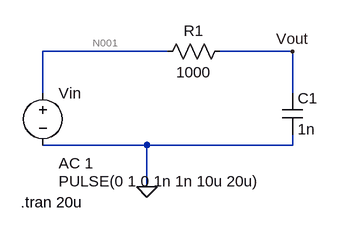
[diagram p0: schematic Draft1.asc]
Draft1.asc, the LTspice schematic file:
Version 4
SHEET 1 880 680
WIRE 160 96 -32 96
WIRE 352 96 240 96
WIRE -32 160 -32 96
WIRE 352 160 352 96
WIRE 128 240 -32 240
WIRE 352 240 352 224
WIRE 352 240 128 240
WIRE 128 304 128 240
FLAG 128 304 0
FLAG 352 96 Vout
SYMBOL res 256 80 R90
WINDOW 0 0 56 VBottom 2
WINDOW 3 32 56 VTop 2
SYMATTR InstName R1
SYMATTR Value 1000
SYMBOL cap 336 160 R0
SYMATTR InstName C1
SYMATTR Value 1n
SYMBOL voltage -32 144 R0
WINDOW 3 24 152 Left 2
WINDOW 123 24 124 Left 2
WINDOW 39 0 0 Left 0
SYMATTR InstName Vin
SYMATTR Value PULSE(0 1 0 1n 1n 10u 20u)
SYMATTR Value2 AC 1
TEXT -66 328 Left 2 !.tran 20u

The netlist it stands for:
* Draft1.asc
R1 Vout N001 1000
C1 Vout 0 1n
Vin N001 0 PULSE(0 1 0 1n 1n 10u 20u) AC 1
.tran 20u
.backanno
.end

* Results of the author's LTspice run, read from the files saved beside the schematic
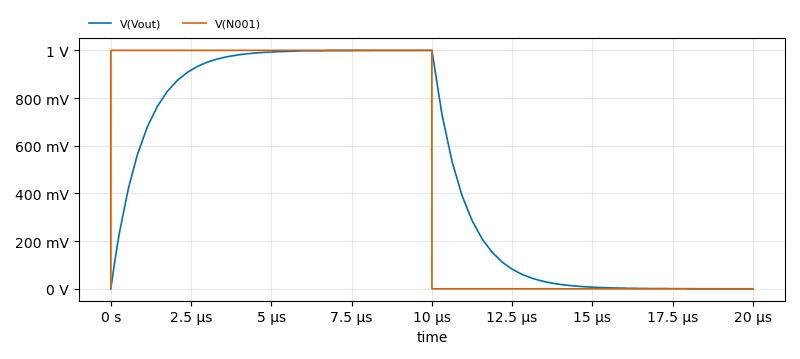
[diagram p1: Transient Analysis of Draft1.asc, plotted from the saved traces]
* Transient Analysis, 1 run:
*   V(Vout): min 0 V, max 1 V, average 500.2 mV, rms 671.4 mV, last 45.45 µV
*   V(N001): min 0 V, max 1 V, average 500.1 mV, rms 707.1 mV, last 0 V